# EAGLE design Snyder1_ESP32_V5 (EAGLE 9.6.2)
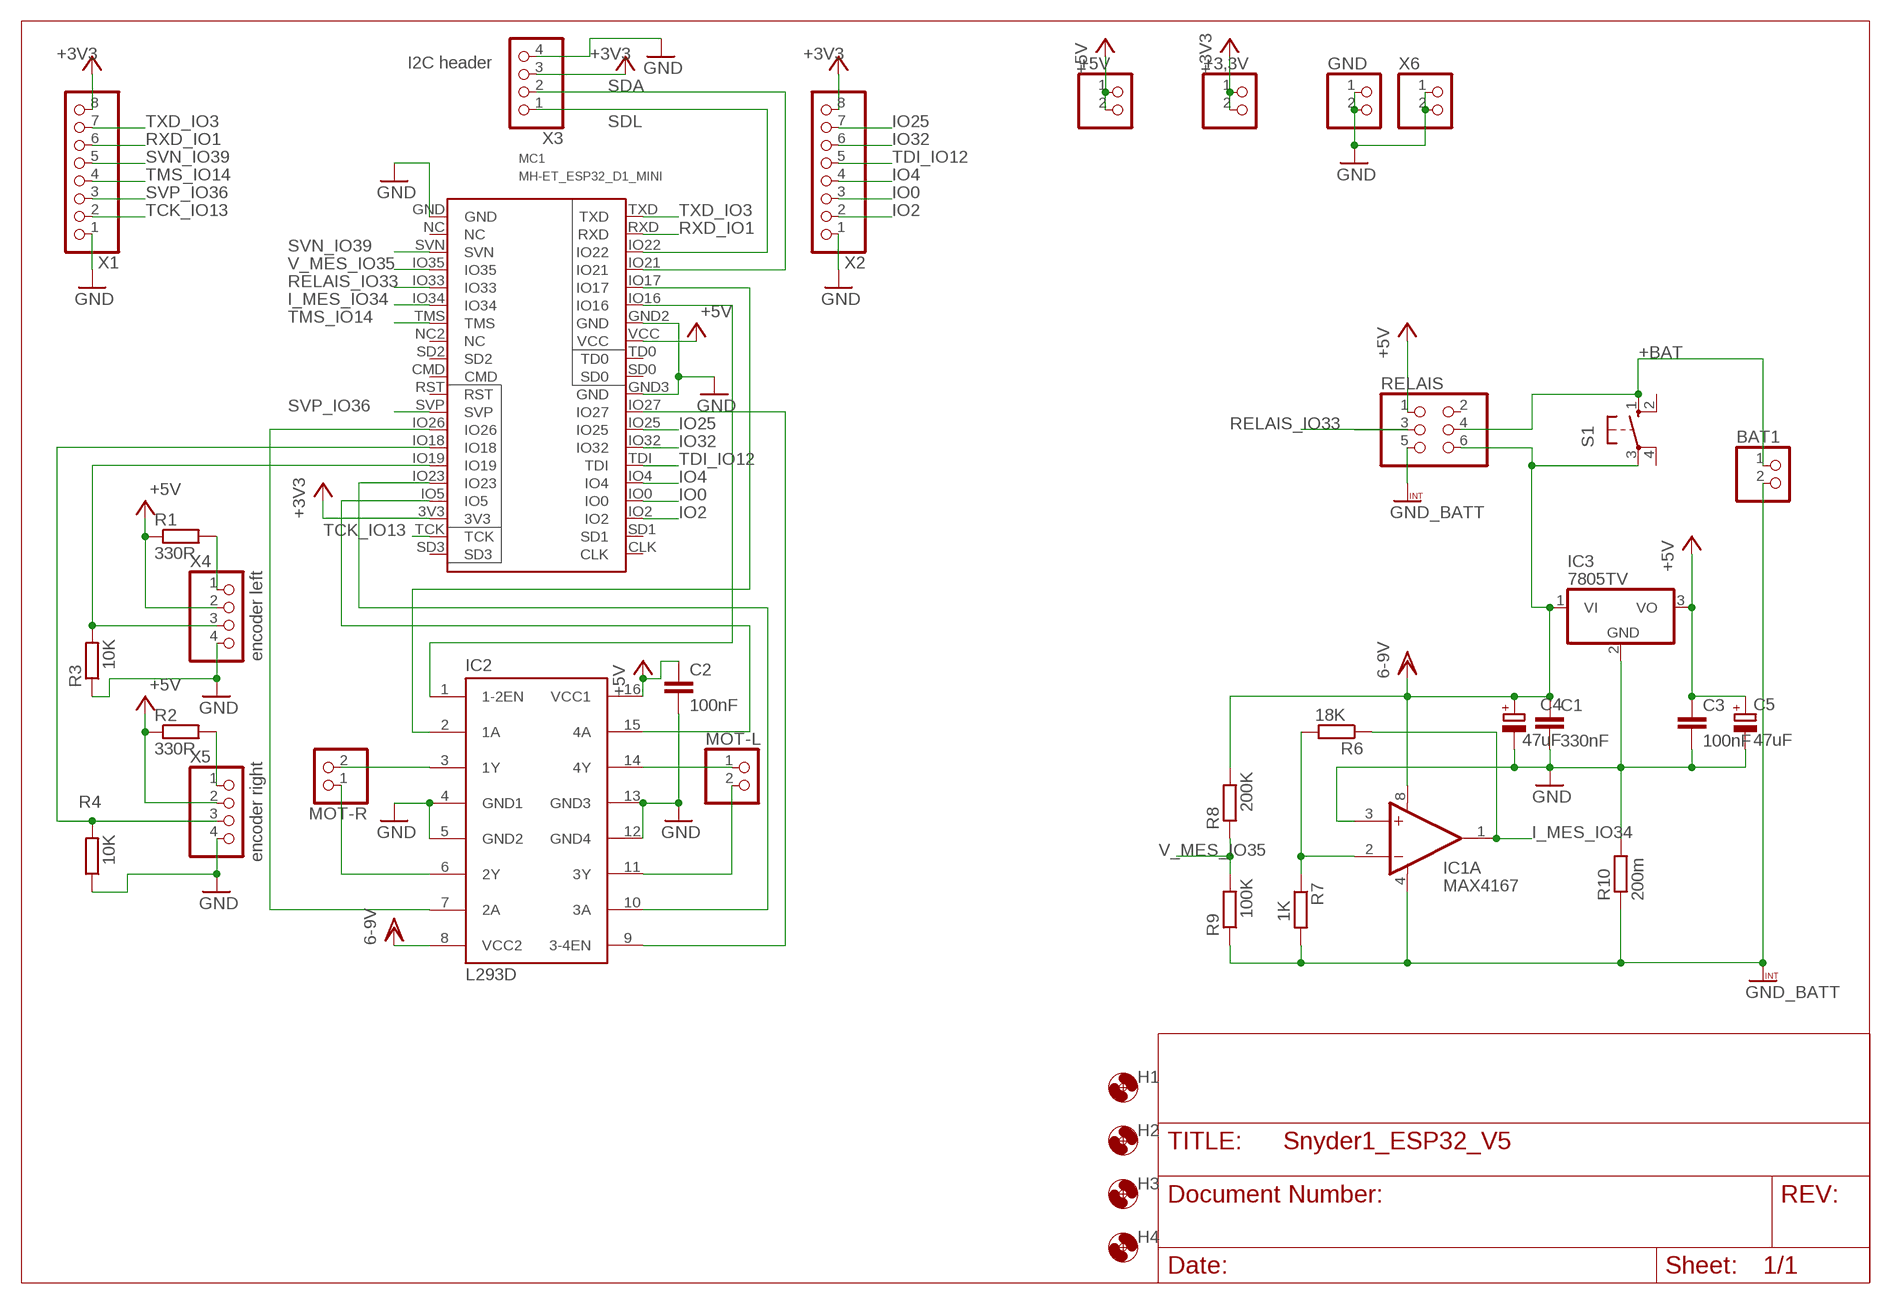
[diagram p0: schematic, sheet 1]

## Parts
+3,3V  PINHD-1X2  [1X02]
+5V  PINHD-1X2  [1X02]
BAT1  PINHD-1X2  [1X02]
C1  330nF  C-EU050-025X075  [C050-025X075]
C2  100nF  C-EU050-025X075  [C050-025X075]
C3  100nF  C-EU050-025X075  [C050-025X075]
C4  47uF  CPOL-EUE2.5-5  [E2,5-5]
C5  47uF  CPOL-EUE2.5-5  [E2,5-5]
GND  PINHD-1X2  [1X02]
H1  MOUNT-HOLE3.2  [3,2]
H2  MOUNT-HOLE3.2  [3,2]
H3  MOUNT-HOLE3.2  [3,2]
H4  MOUNT-HOLE3.2  [3,2]
IC1  MAX4167  MAX412CPA  [DIL08]
IC2  L293D  [DIL16]
IC3  7805TV  [TO220V]
MC1  MH-ET_ESP32_D1_MINI  [MH-ET_ESP32_D1_MINI]
MOT-L  PINHD-1X2  [1X02]
MOT-R  PINHD-1X2  [1X02]
R1  330R  R-EU_0207/10  [0207/10]
R2  330R  R-EU_0207/10  [0207/10]
R3  10K  R-EU_0207/10  [0207/10]
R4  10K  R-EU_0207/10  [0207/10]
R6  18K  R-EU_0207/10  [0207/10]
R7  1K  R-EU_0207/10  [0207/10]
R8  200K  R-EU_0207/10  [0207/10]
R9  100K  R-EU_0207/10  [0207/10]
R10  200m  R-EU_0411/15  [0411/15]
RELAIS  PINHD-2X3  [2X03]
S1  10-XX  [B3F-10XX]
X1  PINHD-1X8  [1X08]
X2  PINHD-1X8  [1X08]
X3  I2C header  PINHD-1X4  [1X04]
X4  encoder left  PINHD-1X4  [1X04]
X5  encoder right  PINHD-1X4  [1X04]
X6  PINHD-1X2  [1X02]

## Nets
6-9V: C1.1 C4.+ IC1.8(A:V+) IC2.8(VCC2) IC3.1(VI) R8.2 RELAIS.6 S1.3(P)
+3V3: +3,3V.1 +3,3V.2 MC1.3V3 X1.8 X2.8 X3.3
+5V [usbvcc]: +5V.1 +5V.2 C2.1 C3.1 C5.+ IC2.16(VCC1) IC3.3(VO) MC1.VCC R1.1 R2.1 RELAIS.1 X4.2 X5.2
+BAT: BAT1.1 RELAIS.4 S1.1(S)
GND [gnd]: C1.2 C2.2 C3.2 C4.- C5.- GND.1 GND.2 IC1.3(A:+IN) IC2.4(GND1) IC2.5(GND2) IC2.12(GND4) IC2.13(GND3) IC3.2(GND) MC1.GND MC1.GND2(GND) MC1.GND3(GND) R3.1 R4.1 R10.2 X1.1 X2.1 X3.4 X4.4 X5.4 X6.1 X6.2
GNDINT: BAT1.2 IC1.4(A:V-) R7.2 R9.1 R10.1 RELAIS.5 ; supply symbol labelled GND_BATT
I_MES_IO34: IC1.1(A:OUT) MC1.IO34 R6.1
IO0: MC1.IO0 X2.3
IO2: MC1.IO2 X2.2
IO4: MC1.IO4 X2.4
IO25: MC1.IO25 X2.7
IO32: MC1.IO32 X2.6
N$1: IC2.3(1Y) MOT-R.2
N$2: IC2.6(2Y) MOT-R.1
N$3: IC2.14(4Y) MOT-L.1
N$4: IC2.11(3Y) MOT-L.2
N$6: IC2.10(3A) MC1.IO23
N$8: IC2.15(4A) MC1.IO5
N$9: R2.2 X5.1
N$10: R1.2 X4.1
N$11: IC2.2(1A) MC1.IO17
N$12: MC1.IO19 R3.2 X4.3
N$13: MC1.IO18 R4.2 X5.3
N$15: IC2.7(2A) MC1.IO26
N$19: IC1.2(A:-IN) R6.2 R7.1
N$20: IC2.1(1-2EN) MC1.IO16
N$21: IC2.9(3-4EN) MC1.IO27
RELAIS_IO33: MC1.IO33 RELAIS.3
RXD_IO1: MC1.RXD X1.6
SDA: MC1.IO21 X3.2
SDL: MC1.IO22 X3.1
SVN_IO39: MC1.SVN X1.5
SVP_IO36: MC1.SVP X1.3
TCK_IO13: MC1.TCK X1.2
TDI_IO12: MC1.TDI X2.5
TMS_IO14: MC1.TMS X1.4
TXD_IO3: MC1.TXD X1.7
V_MES_IO35: MC1.IO35 R8.1 R9.2
Unconnected: IC1.5(B:+IN) IC1.6(B:-IN) IC1.7(B:OUT) MC1.CLK MC1.CMD MC1.NC MC1.NC2(NC) MC1.RST MC1.SD0 MC1.SD1 MC1.SD2 MC1.SD3 MC1.TD0 RELAIS.2 S1.2(S1) S1.4(P1)

## Library data of the parts
+3,3V +5V BAT1 GND MOT-L MOT-R X6 = pinhead:PINHD-1X2: PIN HEADER
C1-C3 = rcl:C-EU: CAPACITOR, European symbol
C4 C5 = rcl:CPOL-EU: POLARIZED CAPACITOR, European symbol; SPICEPREFIX: C
H1-H4 = holes:MOUNT-HOLE: MOUNTING HOLE with drill center marker
IC1 = maxim:MAX412CPA: OP AMP; MPN: MAX412CPA; OC_FARNELL: unknown; OC_NEWARK: 99K3347
IC2 = st-microelectronics:L293D: PUSH-PULL 4 CHANNEL DRIVER; MPN: L293D; OC_FARNELL: 9589619; OC_NEWARK: 56P8249
IC3 = linear:78*: Positive VOLTAGE REGULATOR Source: http://cache.national.com/ds/LM/LM78L05.pdf http://www.fairchildsemi.com/ds/LM/LM7805.pdf
MC1 = MH-ET_ESP32_D1_MINI:MH-ET_ESP32_D1_MINI
R1-R4 R6-R9 = rcl:R-EU_: RESISTOR, European symbol
R10 = rcl:R-EU_: RESISTOR, European symbol; SPICEPREFIX: R
RELAIS = pinhead:PINHD-2X3: PIN HEADER
S1 = switch-omron:10-XX: OMRON SWITCH; MPN: B3F-1000; OC_FARNELL: 176432; OC_NEWARK: 36M3542
X1 X2 = pinhead:PINHD-1X8: PIN HEADER
X3-X5 = pinhead:PINHD-1X4: PIN HEADER

## Net classes
2 gnd: width 0.254 mm, drill 0.61 mm, clearance 0.254 mm
3 usbvcc: width 0.254 mm, drill 0.61 mm, clearance 0.254 mm

## Board
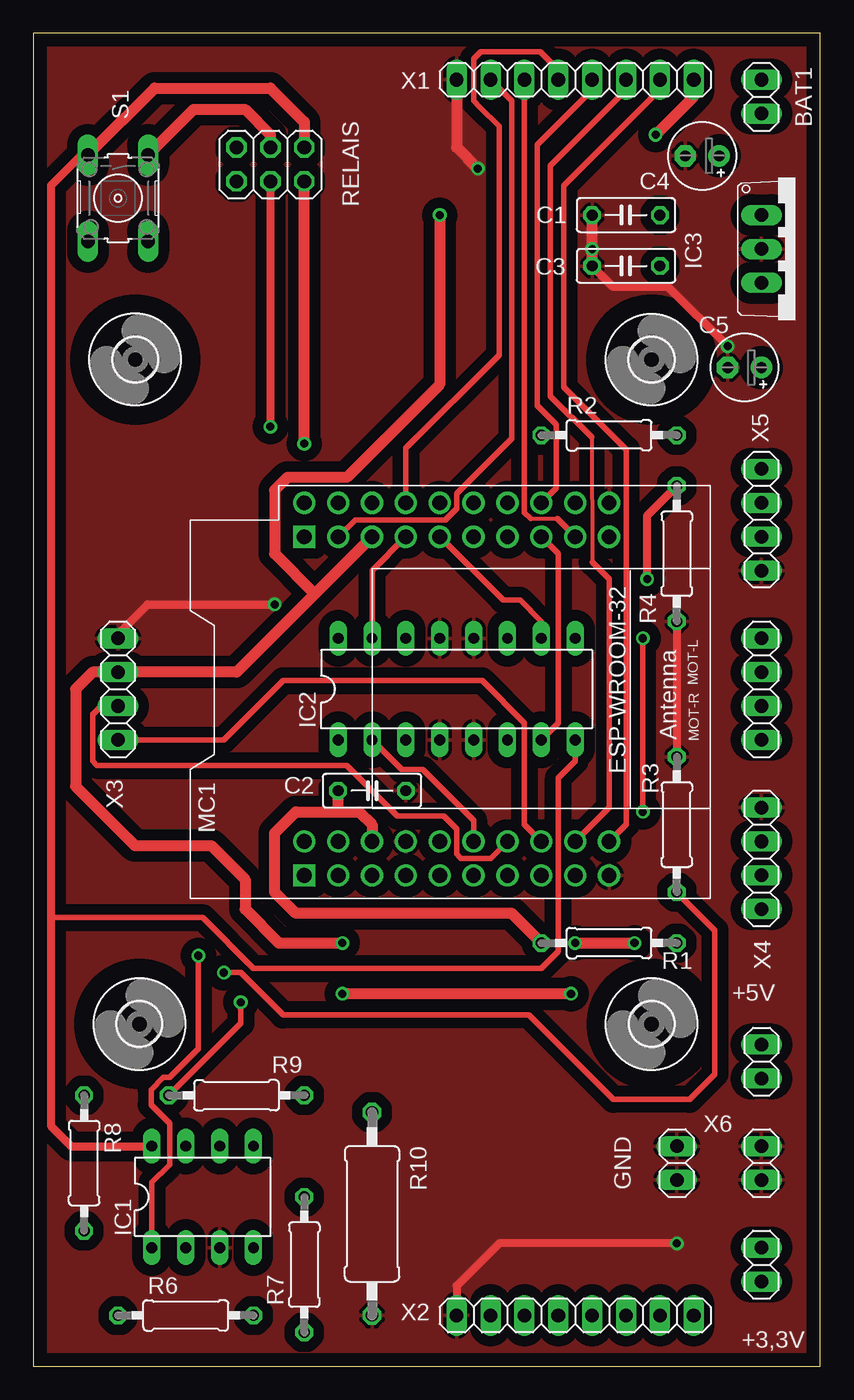
[diagram p1: board, top side]
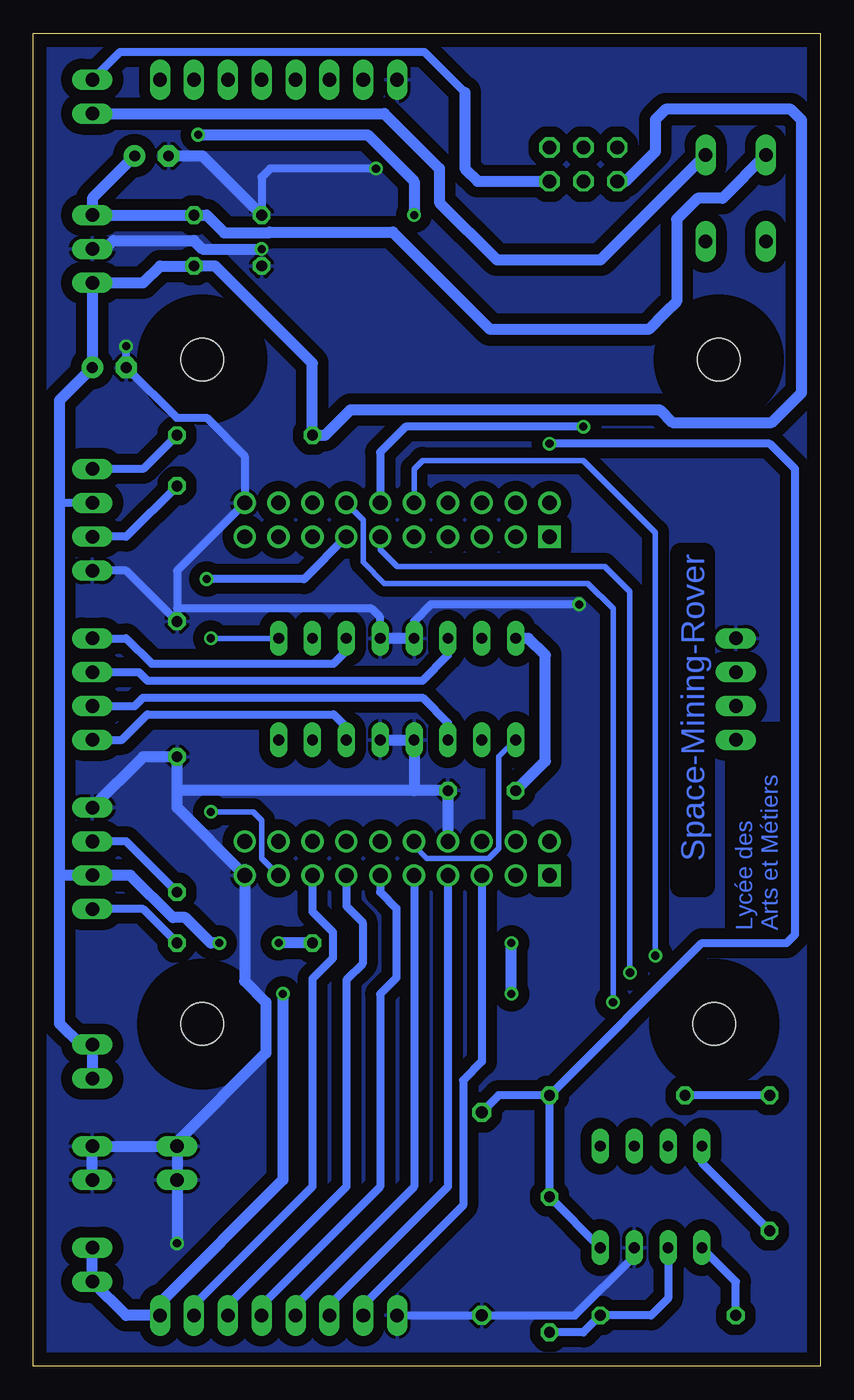
[diagram p2: board, bottom side, seen from below]

Size 59.03 x 100 mm. Coordinates in mm from the lower left corner, seen from the top.
Outline: 0,0 59.03,0 59.03,100 0,100 0,0
Copper layers (1*16): Top 0.035mm / dielectric 1.5mm / Bottom 0.035mm
Design rules "default": minimum track width 6mil, minimum drill 0.35mm, track to track 6mil, track to pad 6mil, pad to pad 6mil, via to via 6mil, smd to smd 6mil, copper to edge 40mil, drill to drill 6mil, minimum pad ring 10mil, minimum via ring 8mil, stop-mask expansion 4mil, vias tented up to drill 0mil, thermal gap 10mil

### Footprints (pad centres in the part's own frame; a part is rotated, then mirrored left to right if it is on the bottom)
1X02 = drill 1.016 long: 1 -1.27,0; 2 1.27,0
C050-025X075 = drill 0.813 octagon: 1 -2.54,0; 2 2.54,0
E2,5-5 = drill 0.813 pad 1.6: + -1.27,0 | drill 0.813 pad 1.6 octagon: - 1.27,0
3,2 = hole 3.2: 0,0
DIL08 = drill 0.813 long: 1 -3.81,-3.81; 2 -1.27,-3.81; 3 1.27,-3.81; 4 3.81,-3.81; 5 3.81,3.81; 6 1.27,3.81; 7 -1.27,3.81; 8 -3.81,3.81
DIL16 = drill 0.813 long: 1 -8.89,-3.81; 2 -6.35,-3.81; 3 -3.81,-3.81; 4 -1.27,-3.81; 5 1.27,-3.81; 6 3.81,-3.81; 7 6.35,-3.81; 8 8.89,-3.81; 9 8.89,3.81; 10 6.35,3.81; 11 3.81,3.81; 12 1.27,3.81; 13 -1.27,3.81; 14 -3.81,3.81; 15 -6.35,3.81; 16 -8.89,3.81
TO220V = drill 1.016 long: 1 -2.54,-2.54; 2 0,-2.54; 3 2.54,-2.54
MH-ET_ESP32_D1_MINI = drill 1.11 pad 1.665: 3V3 25.4,-5.08; CMD 27.94,0; GND 0,-22.86; GND2 2.54,-7.62; GND3 27.94,-22.86; IO0 0,-7.62; IO2 0,-5.08; IO4 0,-10.16; IO5 25.4,-7.62; IO16 2.54,-10.16; IO17 2.54,-12.7; IO18 25.4,-15.24; IO19 25.4,-12.7; IO21 2.54,-15.24; IO22 2.54,-17.78; IO23 25.4,-10.16; IO25 0,-17.78; IO26 25.4,-17.78; IO27 0,-20.32; IO32 0,-15.24; IO33 27.94,-12.7; IO34 27.94,-10.16; IO35 27.94,-15.24; NC 27.94,-20.32; NC2 27.94,-5.08; RST 25.4,-22.86; RXD 2.54,-20.32; SD0 2.54,0; SD1 0,-2.54; SD2 27.94,-2.54; SVN 27.94,-17.78; SVP 25.4,-20.32; TCK 25.4,-2.54; TD0 2.54,-2.54; TDI 0,-12.7; TMS 27.94,-7.62; TXD 2.54,-22.86; VCC 2.54,-5.08 | drill 1.11 pad 1.665 square: CLK 0,0; SD3 25.4,0
0207/10 = drill 0.813 octagon: 1 -5.08,0; 2 5.08,0
0411/15 = drill 0.914 octagon: 1 -7.62,0; 2 7.62,0
2X03 = drill 1.016 octagon: 1 -2.54,-1.27; 2 -2.54,1.27; 3 0,-1.27; 4 0,1.27; 5 2.54,-1.27; 6 2.54,1.27
B3F-10XX = drill 1.016 long: 1 -3.251,2.261; 2 3.251,2.261; 3 -3.251,-2.261; 4 3.251,-2.261
1X08 = drill 1.016 long: 1 -8.89,0; 2 -6.35,0; 3 -3.81,0; 4 -1.27,0; 5 1.27,0; 6 3.81,0; 7 6.35,0; 8 8.89,0
1X04 = drill 1.016 long: 1 -3.81,0; 2 -1.27,0; 3 1.27,0; 4 3.81,0

### Placement (x,y rotation side)
+3,3V  54.61,7.62 90 top
+5V  54.61,22.86 90 top
BAT1  54.61,95.25 90 top
C1  44.45,86.36 180 top
C2  25.4,43.18 0 top
C3  44.45,82.55 180 top
C4  50.16,90.81 180 top
C5  53.34,74.93 180 top
GND  54.61,15.24 90 top
H1  7.96,25.67 0 top
H2  46.36,75.52 0 top
H3  46.37,25.66 0 top
H4  7.64,75.52 0 top
IC1  12.7,12.7 0 top
IC2  31.75,50.8 0 top
IC3  57.15,83.82 270 top
MC1  20.32,36.83 90 top
MOT-L  54.61,53.34 90 top
MOT-R  54.61,48.26 90 top
R1  43.18,31.75 0 top
R2  43.18,69.85 0 top
R3  48.26,40.64 270 top
R4  48.26,60.96 90 top
R6  11.43,3.81 0 top
R7  20.32,7.62 90 top
R8  3.81,15.24 270 top
R9  15.24,20.32 180 top
R10  25.4,11.43 270 top
RELAIS  17.78,90.17 0 top
S1  6.35,87.63 270 top
X1  40.64,96.52 0 top
X2  40.64,3.81 0 top
X3  6.35,50.8 90 top
X4  54.61,38.1 90 top
X5  54.61,63.5 270 top
X6  48.26,15.24 90 top

### Tracks (layer width: path | path; a pad name or v marks a point on that pad's centre or on a via)
6-9V
  Top 0.406: 1.32,33.66 12.7,33.66 16.51,29.84 38.1,29.84 39.37,31.11 39.37,44.13 40.64,45.4 IC2.8
  Top 0.61: S1.3 3.62,90.88 1.32,88.58 1.32,33.66 1.32,18.05 2.86,16.51 IC1.8
  Top 0.813: S1.3 9.09,95.89 17.78,95.89 20.32,93.34 RELAIS.6
  Bottom 0.61: IC1.8 8.89,15.24 R8.2
  Bottom 0.813: C4.+ 54.61,87.63 IC3.1 C1.1 46.04,86.36 44.72,85.04 41.36,85.04 41.31,85.09 32.07,85.09 24.77,77.79 12.88,77.79 11.68,78.99 10.79,79.88 10.79,86.04 9.21,87.63 7.34,87.63 S1.3
+3V3  (via drill 0.61)
  Top 0.813: MC1.3V3 21.11,57.94 | 21.11,57.94 15.24,52.07 X3.3 4.45,52.07 3.17,50.8 3.17,43.5 7.62,39.05 13.34,39.05 15.88,36.51 15.88,34.29 18.41,31.75 v23.18,31.75 | X1.8 49.53,95.25 v46.67,92.39 | v30.48,86.36 30.48,73.66 23.5,66.67 19.05,66.67 18.1,65.72 18.1,60.96 21.11,57.94 | v40.32,27.94 v23.18,27.94
  Bottom 0.813: +3,3V.2 +3,3V.1 52.07,3.81 X2.8 49.53,4.76 40.32,13.97 v40.32,27.94 | v46.67,92.39 33.97,92.39 30.48,88.9 v30.48,86.36 | v23.18,27.94 v23.18,31.75
+5V  (via drill 0.61)
  Top 0.813: R1.1 35.88,33.97 19.68,33.97 18.1,35.56 18.1,40.01 19.68,41.59 22.86,41.59 | 22.86,41.59 24.45,41.59 25.4,40.64 MC1.VCC | 22.86,41.59 C2.1 | v40.64,31.75 v45.09,31.75
  Bottom 0.61: X5.2 57.08,64.77
  Bottom 0.813: 57.08,36.83 57.08,64.77 57.08,72.46 C5.+ IC3.3 50.8,81.28 49.53,82.55 C3.1 45.4,82.55 38.1,75.25 R2.1 37.15,69.85 35.24,71.75 12.06,71.75 11.11,70.8 3.65,70.8 1.42,73.03 1.42,93.5 2.22,94.3 11.61,94.3 12.38,93.53 12.38,91.12 14.61,88.9 RELAIS.1 | 57.08,36.83 57.08,25.72 55.49,24.13 +5V.2 +5V.1 | 57.08,36.83 X4.2 51.75,36.83 48.58,33.66 47.62,33.66 45.72,31.75 v45.09,31.75 | C2.1 20.64,45.4 20.64,53.34 21.91,54.61 IC2.16 | R1.1 v40.64,31.75
+BAT
  Top 0.813: S1.1 12.03,94.3 15.88,94.3 17.78,92.39 RELAIS.4
  Bottom 0.813: BAT1.1 32.7,93.98 28.57,89.85 28.57,87.31 24.27,83.01 16.48,83.01 S1.1
GND  (via drill 0.61)
  Top 0.61: v52.07,76.52 47.62,80.96 43.5,80.96 C3.2 | v48.26,9.21 34.92,9.21 31.75,6.03 X2.1 | R4.1 R3.1 | X3.4 6.35,54.93 8.57,57.15 v18.1,57.15
  Top 0.813: C3.2 v41.91,83.82 C1.2 | X1.1 31.75,91.44 v33.34,89.85
  Bottom 0.61: IC1.3 13.97,8.26 18.41,3.81 R10.2 X2.1 | v52.07,76.52 C5.- 48.29,71.15 46.04,71.15 43.18,68.29 MC1.GND3 48.26,59.69 48.26,56.83 | X5.4 52.07,59.69 R4.1 48.26,56.83 | IC2.12 33.02,56.2 33.66,56.83 48.26,56.83 | v33.34,89.85 41.27,89.85 41.91,89.22 C1.2 | v18.1,57.15 29.21,57.15 30.48,55.88 IC2.13
  Bottom 0.813: C4.- 46.35,90.81 C1.2 | IC3.2 53.66,83.82 53.02,84.45 46.99,84.45 46.35,83.82 v41.91,83.82 | GND.1 GND.2 X6.2 | X6.2 X6.1 v48.26,9.21 | X4.4 50.8,45.72 R3.1 48.26,43.18 | 48.26,43.18 48.26,41.91 MC1.GND 43.18,28.89 41.59,27.3 41.59,23.5 48.26,16.83 X6.2 | MC1.GND2 C2.2 30.48,43.18 | 30.48,43.18 48.26,43.18 | IC2.13 IC2.12 | IC2.5 IC2.4 30.48,43.18
  pour Bottom (isolate 0.813): 0,100.01 0,0 59.05,0 59.05,100.01
  pour Top (isolate 0.813): 0,100.01 0,0 59.05,0 59.05,100.01
GNDINT  (via drill 0.61)
  Top 0.813: v20.32,69.22 RELAIS.5
  Bottom 0.61: R9.1 24.13,20.32 R10.1 | IC1.4 R7.2 R9.1 | R9.1 8.89,31.75 2.54,31.75 1.91,32.38 1.91,67.31 3.81,69.22 v20.32,69.22 | BAT1.2 52.53,98.6 29.7,98.6 26.67,95.57
  Bottom 0.813: 26.67,95.57 26.67,89.85 25.72,88.9 RELAIS.5
I_MES_IO34  (via drill 0.61)
  Top 0.406: v12.38,30.8 12.38,23.81 10.22,21.65 9.74,21.65 8.83,20.74 8.83,19.62 10.22,18.23 10.22,15.11 8.89,13.78 IC1.1
  Bottom 0.406: MC1.IO34 30.48,67.31 29.84,67.94 17.78,67.94 12.38,62.55 v12.38,30.8
  Bottom 0.61: R6.1 6.35,6.35 IC1.1
IO0
  Bottom 0.61: X2.3 36.83,4.57 27.94,13.46 MC1.IO0
IO2
  Bottom 0.61: MC1.IO2 25.4,22.86 26.8,21.46 26.8,12.06 34.29,4.57 X2.2
IO4
  Bottom 0.61: X2.4 39.37,4.57 30.48,13.46 MC1.IO4
IO25
  Bottom 0.61: MC1.IO25 38.1,34.11 36.56,32.57 36.56,30.61 38.1,29.07 38.1,13.46 46.99,4.57 X2.7
IO32
  Bottom 0.61: MC1.IO32 35.56,34.53 34.34,33.31 34.34,30.19 35.56,28.97 35.56,13.46 44.45,4.57 X2.6
N$1
  Bottom 0.61: MOT-R.2 51.44,49.53 50.8,50.16 29.84,50.16 27.94,48.26 IC2.3
N$2
  Bottom 0.61: MOT-R.1 52.39,46.99 50.48,48.9 36.51,48.9 35.56,47.94 IC2.6
N$3
  Bottom 0.61: MOT-L.1 51.12,52.07 50.48,51.44 29.84,51.44 27.94,53.34 IC2.14
N$4
  Bottom 0.61: MOT-L.2 52.07,54.61 50.16,52.7 36.51,52.7 35.56,53.66 IC2.11
N$6
  Top 0.406: MC1.IO23 35.24,57.47 36.51,57.47 38.1,55.88 IC2.10
N$8
  Top 0.406: IC2.15 25.4,59.69 MC1.IO5
N$9
  Bottom 0.61: R2.2 50.8,67.31 X5.1
N$10
  Bottom 0.61: R1.2 50.8,34.29 X4.1
N$11
  Top 0.406: IC2.2 27.62,44.77 29.21,44.77 33.02,40.96 MC1.IO17
N$12  (via drill 0.61)
  Top 0.406: R3.2 51.12,32.7 51.12,21.91 49.21,20 43.5,20 37.15,26.35 18.73,26.35 15.56,29.53 v14.29,29.53
  Bottom 0.406: v14.29,29.53 14.29,58.1 16.19,60.01 31.75,60.01 33.02,61.28 MC1.IO19
  Bottom 0.61: R3.2 52.07,39.37 X4.3
N$13  (via drill 0.61)
  Top 0.61: v46.04,59.05 46.04,63.82 R4.2
  Bottom 0.61: R4.2 52.07,62.23 X5.3 | MC1.IO18 38.73,59.05 v46.04,59.05
N$15
  Top 0.406: MC1.IO26 39.37,60.96 39.37,48.26 IC2.7
N$19
  Bottom 0.61: IC1.2 11.43,5.08 12.7,3.81 R6.2 17.78,2.54 R7.1
N$20
  Bottom 0.406: IC2.1 24.11,45.74 24.11,38.84 24.87,38.08 28.47,38.08 28.49,38.1 29.53,38.1 30.48,39.05 MC1.IO16
N$21  (via drill 0.61)
  Top 0.406: v45.72,41.59 v45.72,54.61
  Bottom 0.406: MC1.IO27 41.91,38.1 41.91,40.96 42.55,41.59 v45.72,41.59 | v45.72,54.61 IC2.9
RELAIS_IO33  (via drill 0.61)
  Top 0.61: RELAIS.3 v17.78,70.48
  Bottom 0.61: v17.78,70.48 31.11,70.48 33.02,68.58 MC1.IO33
RXD_IO1
  Top 0.305: 41.87,69.69 41.91,60.33
  Top 0.406: 41.91,60.33 43.18,59.05 43.18,41.91 MC1.RXD | 41.87,69.69 38.77,72.79 38.77,90.08 44.45,95.76 X1.6
SDA
  Top 0.406: X3.2 5.08,49.53 4.45,48.9 4.45,45.4 4.76,45.09 23.5,45.09 27.3,41.27 30.8,41.27 31.75,40.32 31.75,38.42 32.07,38.1 34.29,38.1 MC1.IO21
SDL
  Top 0.406: X3.1 14.29,46.99 18.73,51.44 33.66,51.44 36.83,48.26 36.83,40.64 MC1.IO22
SVN_IO39
  Top 0.406: MC1.SVN 39.22,65.89 39.22,70.64 37.78,72.07 37.78,91.63 41.91,95.76 X1.5
SVP_IO36
  Top 0.305: 37.29,63.58 39.29,63.58
  Top 0.406: 39.29,63.58 MC1.SVP | 37.29,63.58 36.83,64.04 X1.3
TCK_IO13
  Top 0.406: MC1.TCK 24.13,63.5 30.89,63.5 31.75,64.36 31.75,65.48 35.88,69.61 35.88,94.93 X1.2
TDI_IO12
  Bottom 0.61: MC1.TDI 33.02,35.58 31.8,34.36 31.8,29.14 33.02,27.92 33.02,13.46 41.91,4.57 X2.5
TMS_IO14
  Top 0.406: MC1.TMS 27.94,68.87 34.92,75.85 34.92,93.03 33.5,94.46 33.02,94.93 33.02,98.11 33.54,98.63 38.02,98.63 39.37,97.28 X1.4
TXD_IO3
  Top 0.406: MC1.TXD 44.47,40.66 44.47,68.77 39.78,73.46 39.78,88.55 46.99,95.76 X1.7
V_MES_IO35  (via drill 0.61)
  Top 0.406: R9.2 15.56,25.72 v15.56,27.3
  Bottom 0.406: v15.56,27.3 15.56,56.83 17.46,58.74 32.7,58.74 34.29,60.33 34.29,63.5 MC1.IO35
  Bottom 0.61: R8.1 R9.2

### Text on the board
Bottom: Space-Mining-Rover | Lycée des / Arts et Métiers
Document: GND_BAT | com | NO | IO3 | +3V3 | +6-9V | GND | IO13 | IO36 | IO14 | IO39 | IO1 | +5V | IO33 | GND | Space-Mining-Rover | DA | +5V | VO | GND/DK | GND | 3V3 | SDA | SDL | GND/DK | VO | +5V | DA | Lycée des / Arts et Métiers | GND | IO2 | IO0 | IO4 | IO12 | IO32 | IO25 | +3V3